# EAGLE schematic MicTonpegel (EAGLE 6.0)
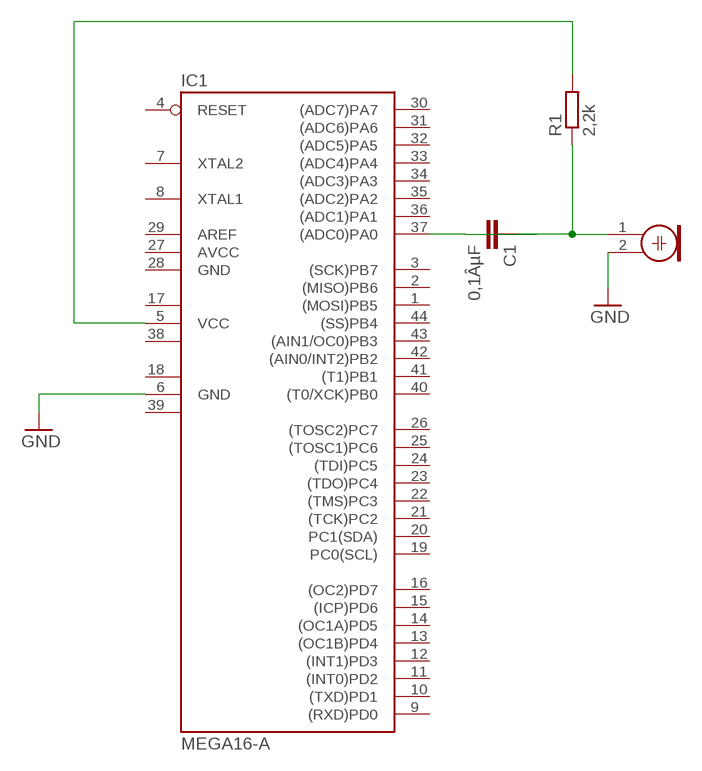
[diagram p0: schematic, sheet 1]

## Parts
C1  0,1ÂµF  C2,5-3  [C2.5-3]
IC1  MEGA16-A  [TQFP44]
M1  ELECTRET_MICROPHON-F6035AP  [F6035AP]
R1  2,2k  R-EU_0207/2V  [0207/2V]

## Nets
GND: IC1.6(GND) M1.2
N$1: IC1.5(VCC) R1.2
N$2: C1.1 M1.1 R1.1
N$3: C1.2 IC1.37((ADC0)PA0)
Unconnected: IC1.1((MOSI)PB5) IC1.2((MISO)PB6) IC1.3((SCK)PB7) IC1.4(RESET) IC1.7(XTAL2) IC1.8(XTAL1) IC1.9((RXD)PD0) IC1.10((TXD)PD1) IC1.11((INT0)PD2) IC1.12((INT1)PD3) IC1.13((OC1B)PD4) IC1.14((OC1A)PD5) IC1.15((ICP)PD6) IC1.16((OC2)PD7) IC1.19(PC0(SCL)) IC1.20(PC1(SDA)) IC1.21((TCK)PC2) IC1.22((TMS)PC3) IC1.23((TDO)PC4) IC1.24((TDI)PC5) IC1.25((TOSC1)PC6) IC1.26((TOSC2)PC7) IC1.29(AREF) IC1.30((ADC7)PA7) IC1.31((ADC6)PA6) IC1.32((ADC5)PA5) IC1.33((ADC4)PA4) IC1.34((ADC3)PA3) IC1.35((ADC2)PA2) IC1.36((ADC1)PA1) IC1.40((T0/XCK)PB0) IC1.41((T1)PB1) IC1.42((AIN0/INT2)PB2) IC1.43((AIN1/OC0)PB3) IC1.44((SS)PB4)

## Power pins joined to a net without a drawn wire
AVCC: IC1.27(AVCC)
GND: IC1.28(GND)
GND1: IC1.18(GND1)
GND2: IC1.39(GND2)
VCC1: IC1.17(VCC1)
VCC2: IC1.38(VCC2)

## Library data of the parts
C1 = capacitor-wima:C: CAPACITOR naming: grid - package width
IC1 = atmel:MEGA16: MICROCONTROLLER 16 Kbytes FLASH 1 kbytes SRAM 512 bytes EEPROM USART 8-channel 10 bit ADC Source: avr.lbr; MPN: ATMEGA16-16AU; OC_FARNELL: 9171134; OC_NEWARK: 96K6515
M1 = microphon:ELECTRET_MICROPHON-: Electret Condenser Microphone
R1 = resistor:R-EU_: RESISTOR, European symbol